# Altium schematic sheet 1V1_REG.SchDoc
size A; SheetNumber: 21; SheetTotal: 21
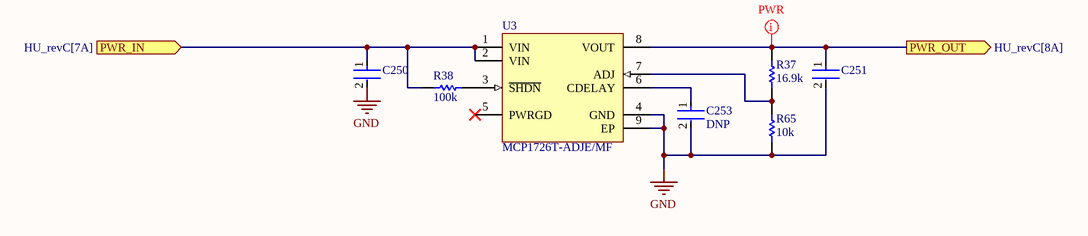
[diagram p0: 1V1_REG.SchDoc]

## Parts
C250  C0805C475J4RACAUTO  [FP-C0805C475J4RACAUTO-MFG]  (value not drawn)
C251  GRM21BR61E226ME44L  [FP-GRM21B-0_2-e0_2_0_7-IPC_B]  (value not drawn)
C253  DNP  [FP-0402-L_1_0_0_05-W_0_5-IPC_A]
R37  16.9k  [R0603B]
R38  100k  [R0603B]
R65  10k  [R0603B]
U3  MCP1726T-ADJE/MF  [DFN-MF8]

## Ports
PWR_IN (in, see HU_revC[7A]), PWR_OUT (out, see HU_revC[8A])

## Nets
GND: C250.2 C251.2 C253.2 R65.1 U3.4(GND) U3.9(EP)
PWR_IN: C250.1 R38.1 U3.1(VIN) U3.2(VIN) ; port PWR_IN
PWR_OUT: C251.1 R37.2 U3.8(VOUT) ; port PWR_OUT
NetC253_1: C253.1 U3.6(CDELAY)
NetR37_1: R37.1 R65.2 U3.7(ADJ)
NetR38_2: R38.2 U3.3(~{SHDN})

Not connected (* = marked no-connect by the designer): U3 5(PWRGD)*

## Layout directives
net class PWR: PWR_OUT

## Library data of the parts
C250 = CMP-00212-84766729-1: C0805C475J4RACAUTO Cap Ceramic 4.7uF 16V X7R 5% Pad SMD 0805 125C Automotive T/R; Capacitance: 4.7µF; Max Operating Temperature: 125°C; Dielectric Material: Ceramic; Voltage Rating (DC): 16V; Dielectric: X7R; Height: 1.4mm; Case/Package: 0805; NexarPartId: 84766729; Voltage Rating: 16V; RoHS: Compliant; Material: Ceramic; Packaging: Cut Tape; Tolerance: 5%; Min Operating Temperature: -55°C
C251 = CMP-2007-03222-3: Chip Multilayer Ceramic Capacitors for General Purpose, 0805, 22uF, X5R, 15%, 20%, 25V; Case/Package: 0805; Depth: 1.25mm; Resistor Type: Ceramic; Voltage Rating: 25V; Lead Free: Lead Free; Voltage Rating (DC): 25V; Case Code (Metric): 2012; Thickness: 0.057inch; REACH SVHC: No SVHC; Material: Ceramic; Tolerance: 20%; Length: 2mm; Capacitance: 22uF; Case Code (Imperial): 0805; Max Operating Temperature: 85°C; Termination: SMD/SMT; Weight: 0.000335oz; Dielectric: X5R; Packaging: Tape and Reel; Voltage: 25V; Package Quantity: 3000; Height: 1.25mm; Mount: Surface Mount; Width: 1.25mm; Min Operating Temperature: -55°C
C253 = CMP-001-00058-1: LARGE PADS, 0402 CAP, CHANGE COMMENT TO MATCH REAL P/N; Capacitor Type: Ceramic; Min Operating Temperature: -55°C; Mounting Technology: Surface Mount; Pins: 2; Case/Package: 0402; RoHS Compliant: Yes; Max Operating Temperature: 85°C
R37 R38 R65 = CMP-009-00002-14: Resistor
  R37: Value: 16.9k
  R38: Value: 100k
  R65: Value: 10k
U3 = CMP-0136-00358-1: 1A, Low Voltage, Low Quiescent Current LDO Regulator, 8-Pin DFN, Extended Temperature, Tape and Reel; DatasheetVersion: revC, Aug-2007; PackageDescription: 8-Lead Plastic Dual Flat, No Lead Package (MF) - 3x3x0.9mm Body [DFN]; PackageVersion: revBB, Aug-2009; PackageReference: DFN-MF8